# EAGLE design JTAG10M-STLV2 (EAGLE 6.4)
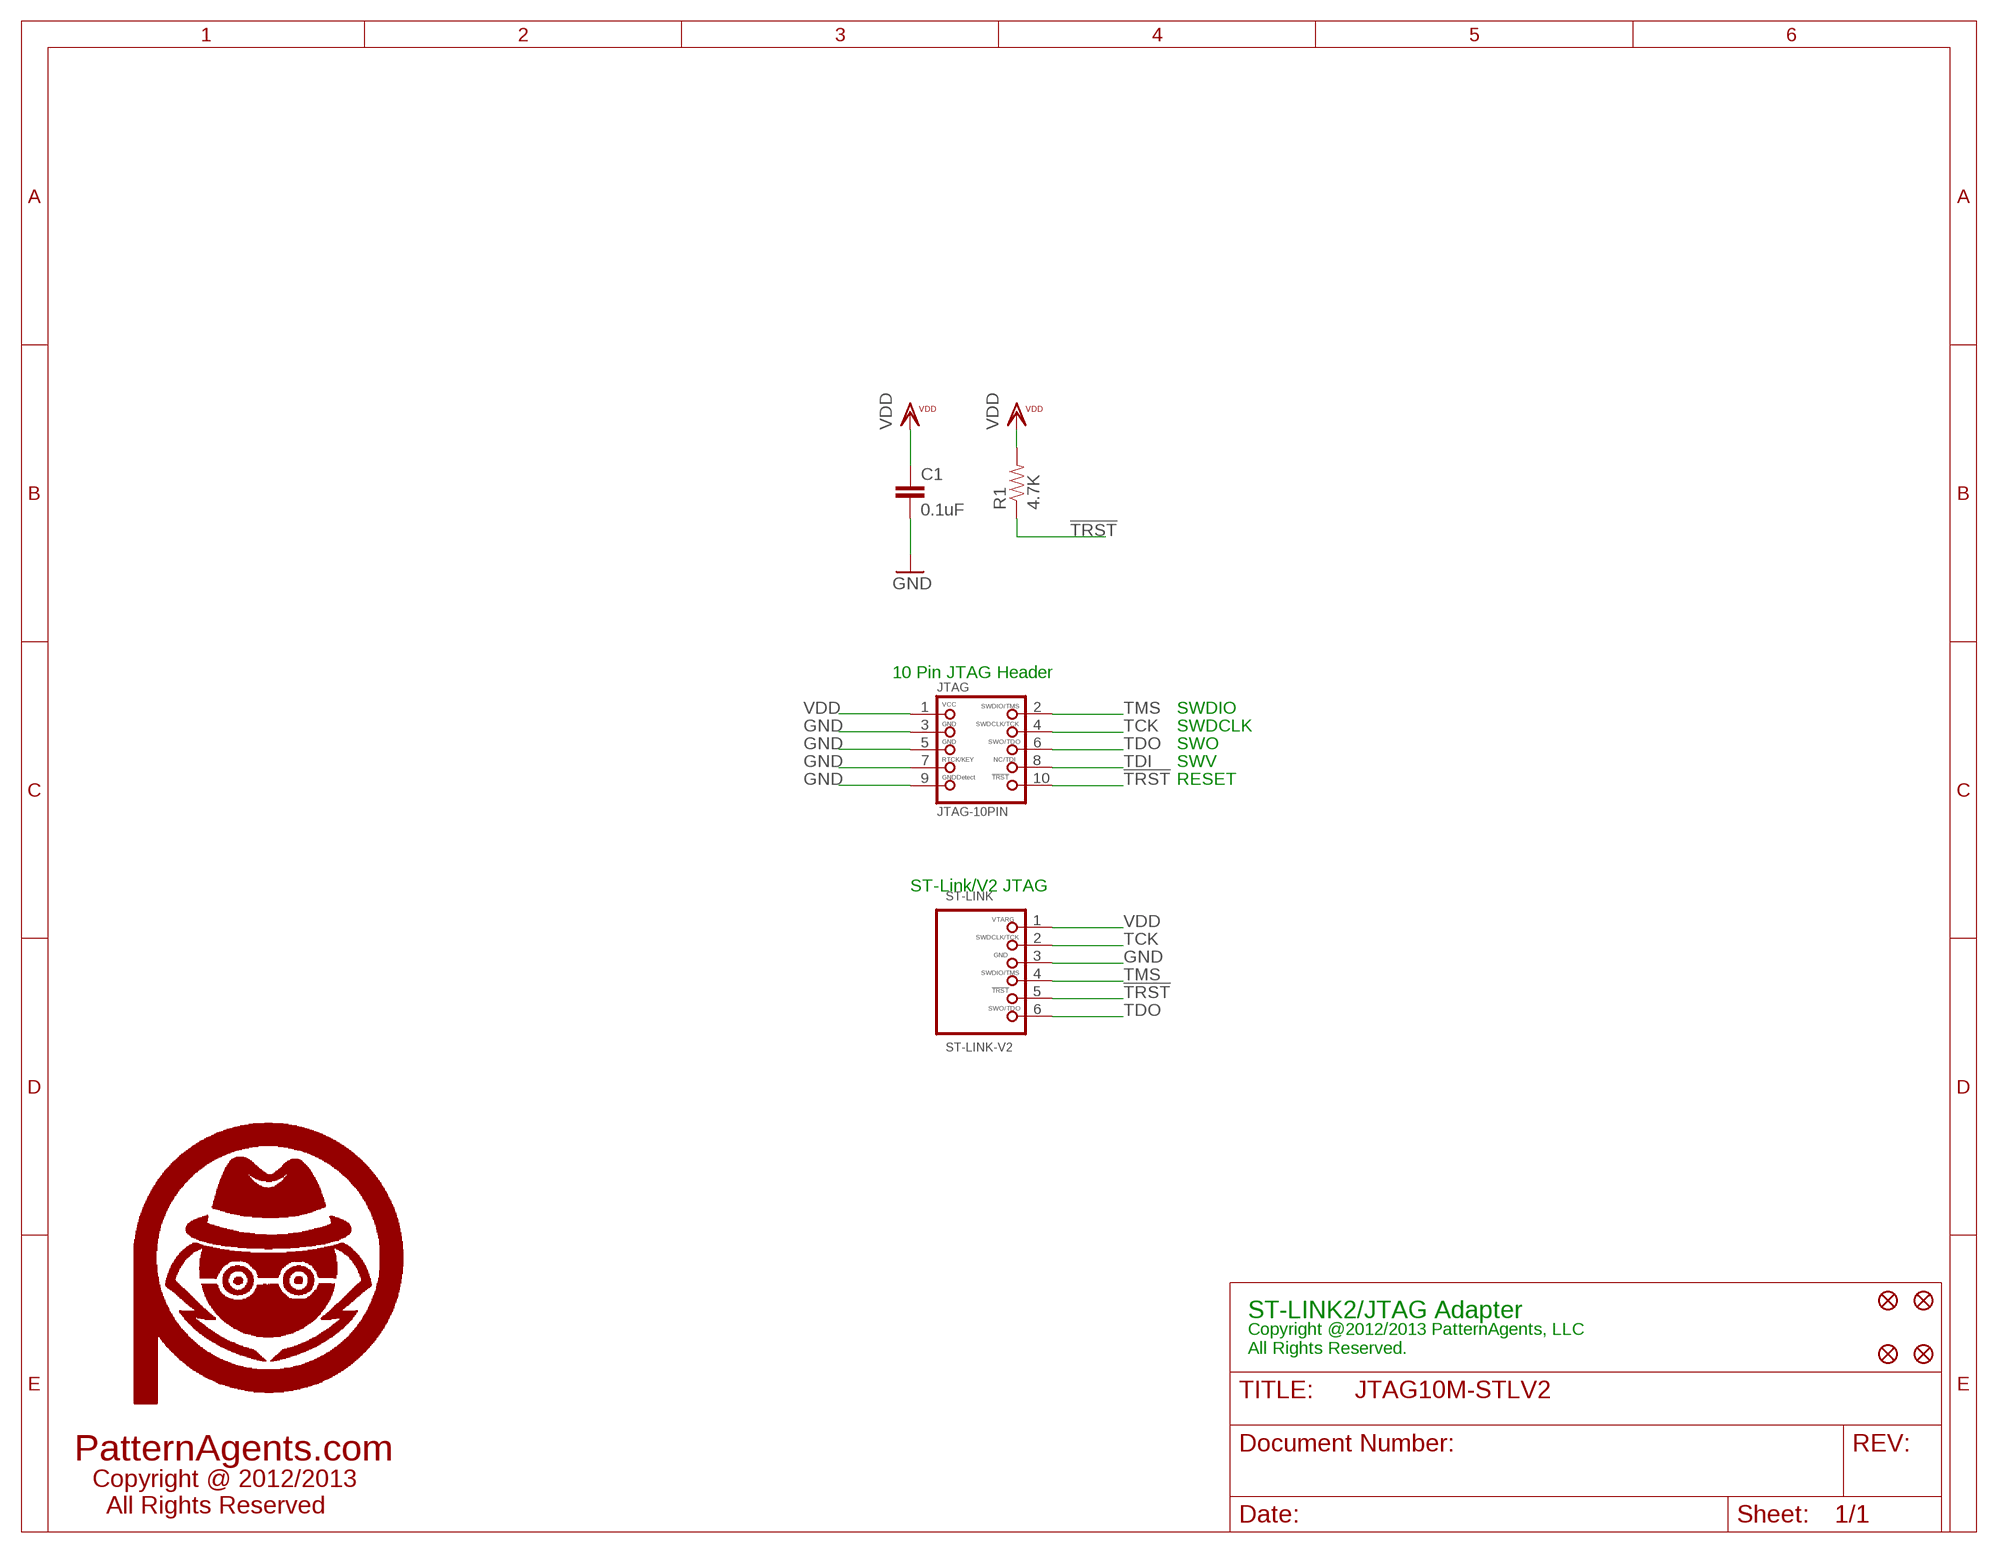
[diagram p0: schematic, sheet 1]

## Parts
C1  0.1uF  CAP0603-CAP  [0603-CAP]
FID1  FIDUCIAL1.5X3  [FIDUCIAL-1.5X3]
FID2  FIDUCIAL1.5X3  [FIDUCIAL-1.5X3]
FID3  FIDUCIAL1.5X3  [FIDUCIAL-1.5X3]
FID4  FIDUCIAL1.5X3  [FIDUCIAL-1.5X3]
JTAG  JTAG-10PIN  JTAG-10PINSMD  [2X05_1.27MM_SMT]
R1  4.7K  RESISTOR_SFE0603-RES  [0603-RES]
ST-LINK  ST-LINK-V2  [1X06_2.54MM_PTH]
U$2  PA_LOGO_SYMLARGE  [PA_LOGO_AGENT_LRG_SYM]

## Nets
!TRST: JTAG.10 R1.1 ST-LINK.5
GND: C1.2 JTAG.3 JTAG.5 JTAG.7 JTAG.9 ST-LINK.3
TCK: JTAG.4 ST-LINK.2
TDI: JTAG.8
TDO: JTAG.6 ST-LINK.6
TMS: JTAG.2 ST-LINK.4
VDD: C1.1 JTAG.1 R1.2 ST-LINK.1

## Notes on the sheet
- 10 Pin JTAG Header
- SWDIO
- SWDCLK
- SWO
- SWV
- RESET
- ST-Link/V2 JTAG
- ST-LINK2/JTAG Adapter
- Copyright @2012/2013 PatternAgents, LLC
  All Rights Reserved.
- PatternAgents.com
- Copyright @ 2012/2013
    All Rights Reserved

## Library data of the parts
C1 = PatternAgents-Misc:CAP: Capacitor Standard 0603 ceramic capacitor, and 0.1" leaded capacitor.
FID1-FID4 = PatternAgents-Misc:FIDUCIAL: Fiducial Alignment Points Various fiducial points for machine vision alignment.
JTAG = PatternAgents_JTAG:JTAG-10PIN: JTAG 10 Pin (SWD) Programming Connector LBR Source: http://www.patternagents.com THIS SOFTWARE IS PROVIDED BY THE CONTRIBUTORS "AS IS" AND WITHOUT ANY EXPRESS OR IMPLIED WARRANTIES, INCLUDING, BUT NOT LIMITED TO, THE IMPLIED WARRANTIES OF MERCHANTABILITY AND FITNESS FOR A PARTICULAR PURPOSE ARE DISCLAIMED. IN NO EVENT SHALL THE COPYRIGHT OWNER OR CONTRIBUTORS BE LIABLE FOR ANY DIRECT, INDIRECT, INCIDENTAL, SPECIAL, EXEMPLARY, OR CONSEQUENTIAL DAMAGES (INCLUDING, BUT NOT LIMITED TO, PROCUREMENT OF SUBSTITUTE GOODS OR SERVICES; LOSS OF USE, DATA, OR PROFITS; OR BUSINESS INTERRUPTION) HOWEVER CAUSED AND ON ANY THEORY OF LIABILITY, WHETHER IN CONTRACT, STRICT LIABILITY, OR TORT (INCLUDING NEGLIGENCE OR OTHERWISE) ARISING IN ANY WAY OUT OF THE USE OF THIS SOFTWARE, EVEN IF ADVISED OF THE POSSIBILITY OF SUCH DAMAGE.
R1 = PatternAgents-Misc:RESISTOR_SFE: Resistor Basic schematic elements and footprints for 0603, 1206, and PTH resistors.
ST-LINK = PatternAgents_JTAG:ST-LINK-V2: ST-Link/V2 JTAG/SWD Connector LBR Source: http://www.patternagents.com Data Source : http://www.st.com/st-web-ui/static/active/en/resource/technical/document/user_manual/DM00039084.pdf THIS SOFTWARE IS PROVIDED BY THE CONTRIBUTORS "AS IS" AND WITHOUT ANY EXPRESS OR IMPLIED WARRANTIES, INCLUDING, BUT NOT LIMITED TO, THE IMPLIED WARRANTIES OF MERCHANTABILITY AND FITNESS FOR A PARTICULAR PURPOSE ARE DISCLAIMED. IN NO EVENT SHALL THE COPYRIGHT OWNER OR CONTRIBUTORS BE LIABLE FOR ANY DIRECT, INDIRECT, INCIDENTAL, SPECIAL, EXEMPLARY, OR CONSEQUENTIAL DAMAGES (INCLUDING, BUT NOT LIMITED TO, PROCUREMENT OF SUBSTITUTE GOODS OR SERVICES; LOSS OF USE, DATA, OR PROFITS; OR BUSINESS INTERRUPTION) HOWEVER CAUSED AND ON ANY THEORY OF LIABILITY, WHETHER IN CONTRACT, STRICT LIABILITY, OR TORT (INCLUDING NEGLIGENCE OR OTHERWISE) ARISING IN ANY WAY OUT OF THE USE OF THIS SOFTWARE, EVEN IF ADVISED OF THE POSSIBILITY OF SUCH DAMAGE.
U$2 = PatternAgents-Logos:PA_LOGO_SYM: PatternAgents Logo Symbol Trademark : PatternAgents, LLC Github : https://github.com/PatternAgents/PCB_Libraries License : http://creativecommons.org/licenses/by-sa/3.0/ (Creative Commons 3.0) THIS SOFTWARE IS PROVIDED BY THE CONTRIBUTORS "AS IS" AND WITHOUT ANY EXPRESS OR IMPLIED WARRANTIES, INCLUDING, BUT NOT LIMITED TO, THE IMPLIED WARRANTIES OF MERCHANTABILITY AND FITNESS FOR A PARTICULAR PURPOSE ARE DISCLAIMED. IN NO EVENT SHALL THE COPYRIGHT OWNER OR CONTRIBUTORS BE LIABLE FOR ANY DIRECT, INDIRECT, INCIDENTAL, SPECIAL, EXEMPLARY, OR CONSEQUENTIAL DAMAGES (INCLUDING, BUT NOT LIMITED TO, PROCUREMENT OF SUBSTITUTE GOODS OR SERVICES; LOSS OF USE, DATA, OR PROFITS; OR BUSINESS INTERRUPTION) HOWEVER CAUSED AND ON ANY THEORY OF LIABILITY, WHETHER IN CONTRACT, STRICT LIABILITY, OR TORT (INCLUDING NEGLIGENCE OR OTHERWISE) ARISING IN ANY WAY OUT OF THE USE OF THIS SOFTWARE, EVEN IF ADVISED OF THE POSSIBILITY OF SUCH DAMAGE.

## Board
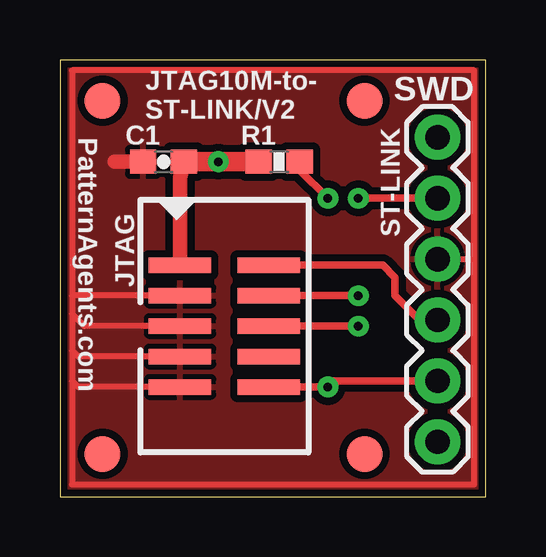
[diagram p1: board, top side]
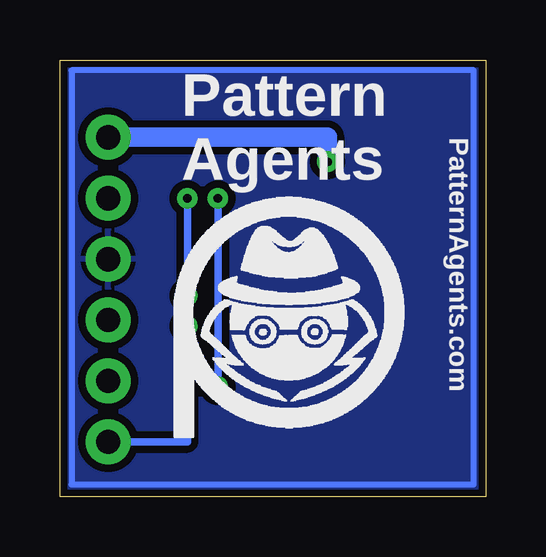
[diagram p2: board, bottom side, seen from below]

Size 17.76 x 18.21 mm. Coordinates in mm from the lower left corner, seen from the top.
Outline: 0,0 17.76,0 17.76,18.21 0,18.21 0,0
Copper layers (1*16): Top 0.035mm / dielectric 1.5mm / Bottom 0.035mm
Design rules "PatternAgents": minimum track width 8mil, minimum drill 14mil, track to track 8mil, track to pad 8mil, pad to pad 8mil, via to via 8mil, smd to smd 8mil, copper to edge 10mil, drill to drill 8mil, minimum pad ring 12mil, minimum via ring 10mil, stop-mask expansion 4mil, vias tented up to drill 25mil, thermal gap 8mil

### Footprints (pad centres in the part's own frame; a part is rotated, then mirrored left to right if it is on the bottom)
0603-CAP = smd 1.1 x 1: 1 -0.85,0; 2 0.85,0
FIDUCIAL-1.5X3 = smd 1.5 x 1.5: 1 0,0
2X05_1.27MM_SMT = smd 0.65 x 2.6: 1 -2.54,-1.85; 2 -2.54,1.85; 3 -1.27,-1.85; 4 -1.27,1.85; 5 0,-1.85; 6 0,1.85; 7 1.27,-1.85; 8 1.27,1.85; 9 2.54,-1.85; 10 2.54,1.85
0603-RES = smd 1.1 x 1: 1 -0.85,0; 2 0.85,0
1X06_2.54MM_PTH = drill 1.016 pad 1.88: 1 0,0; 2 2.54,0; 3 5.08,0; 4 7.62,0; 5 10.16,0; 6 12.7,0

### Placement (x,y rotation side)
C1  4.32,13.97 180 top
FID1  12.7,1.78 270 top
FID2  12.7,16.51 270 top
FID3  1.78,1.78 270 top
FID4  1.78,16.51 270 top
JTAG  6.86,7.11 270 top
R1  9.14,13.97 180 top
ST-LINK  15.75,14.99 270 top
U$2  8.13,6.86 0 bottom

### Tracks (layer width: path | path; a pad name or v marks a point on that pad's centre or on a via)
!TRST  (via drill 0.36)
  Top 0.305: R1.1 9.99,13.63 v11.18,12.45 | JTAG.10 v11.18,4.57 11.18,4.83 ST-LINK.5
  Bottom 0.305: v11.18,12.45 v11.18,4.57
GND
  Top 0.254: ST-LINK.3 17.27,9.91 | 17.27,9.91 17.27,17.78 0.51,17.78 0.51,8.38 | 0.51,8.38 0.51,7.62 | 0.51,7.62 0.51,6.1 | 0.51,6.1 0.51,4.83 | 0.51,4.83 0.51,0.51 17.27,0.51 17.27,9.91 | JTAG.3 0.51,8.38 | JTAG.5 1.02,7.11 0.51,7.62 | JTAG.7 0.76,5.84 0.51,6.1 | JTAG.9 0.76,4.57 0.51,4.83
  Top 0.61: C1.2 2.29,13.97
  Bottom 0.254: 17.27,17.78 17.27,0.51 0.51,0.51 0.51,17.78 17.27,17.78
  pour Bottom (isolate 0.305): 0,0 0,18.29 17.78,18.29 17.78,0
  pour Top (isolate 0.305): 0,0 0,18.29 17.78,18.29 17.78,0
TCK  (via drill 0.36)
  Top 0.305: JTAG.4 v12.45,8.38 | v12.45,12.45 ST-LINK.2
  Bottom 0.305: v12.45,8.38 v12.45,12.45
TDO  (via drill 0.36)
  Top 0.305: v12.45,7.11 JTAG.6
  Bottom 0.305: ST-LINK.6 12.45,2.29 v12.45,7.11
TMS
  Top 0.305: JTAG.2 13.46,9.65 13.97,9.14 13.97,8.38 14.99,7.37 ST-LINK.4
VDD  (via drill 0.36)
  Top 0.61: JTAG.1 5.01,13.3 C1.1
  Top 0.813: C1.1 v6.6,13.97 R1.2
  Bottom 0.813: ST-LINK.1 6.6,14.99 v6.6,13.97

### Text on the board
tPlace: SWD | JTAG10M-to- / ST-LINK/V2 | PatternAgents.com
bPlace: PatternAgents.com | Pattern / Agents